# Altium schematic sheet Sheet2.SchDoc
size A
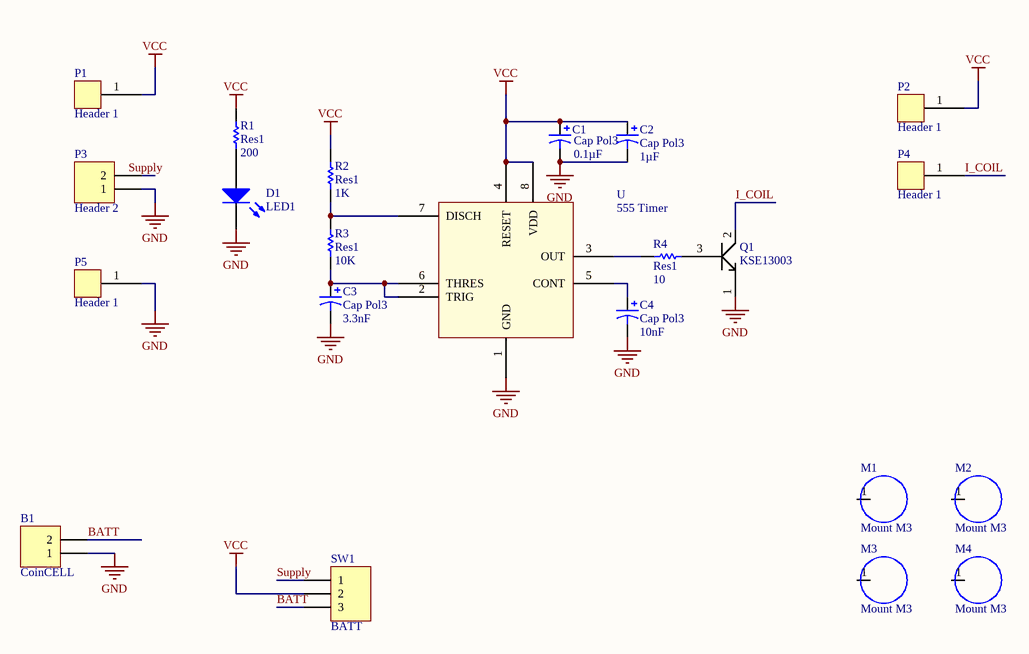
[diagram p0: Sheet2.SchDoc]

## Parts
B1  CoinCELL  [COIN]
C1  Cap Pol3  value 0.1µF  [C0805]
C2  Cap Pol3  value 1µF  [C0805]
C3  Cap Pol3  value 3.3nF  [C0805]
C4  Cap Pol3  value 10nF  [C0805]
D1  LED1  [0805]
M1  Mount M3  [M3]
M2  Mount M3  [M3]
M3  Mount M3  [M3]
M4  Mount M3  [M3]
P1  Header 1  [Pad Edge]
P2  Header 1  [Pad]
P3  Header 2  [Screw Terminal 2-5.08]
P4  Header 1  [Pad]
P5  Header 1  [Pad Edge]
Q1  KSE13003  [TO126]
R1  Res1  value 200  [0805]
R2  Res1  value 1K  [0805]
R3  Res1  value 10K  [0805]
R4  Res1  value 10  [0805]
SW1  BATT  [Switch SPDT BENT]
U  555 Timer  [SOIC8]

## Nets
GND: B1.1 C1.2 C2.2 C3.2 C4.2 D1.2(K) P3.1 P5.1 Q1.1(Emitter) U.1(GND)
VCC: C1.1 C2.1 P1.1 P2.1 R1.2 R2.2 SW1.2 U.4(RESET) U.8(VDD)
BATT: B1.2 SW1.3
I_COIL: P4.1 Q1.2(Coll)
Supply: SW1.1
NetC3_1: C3.1 R3.1 U.2(TRIG) U.6(THRES)
NetC4_1: C4.1 U.5(CONT)
NetD1_1: D1.1(A) R1.1
NetQ1_3: Q1.3(Base) R4.1
NetR2_1: R2.1 R3.2 U.7(DISCH)
NetR4_2: R4.2 U.3(OUT)

Not connected (* = marked no-connect by the designer): M1 1; M2 1; M3 1; M4 1; P3 2

## Notes on the sheet
- Labels drawn without touching a wire or pin: Supply

## Library data of the parts
B1 P3 = Header 2: Header, 2-Pin; LatestRevisionDate: 17-Jul-2002; LatestRevisionNote: Re-released for DXP Platform.; Publisher: Altium Limited
C1-C4 = Cap Pol3: Polarized Capacitor (Surface Mount); Published: 8-Jun-2000; LatestRevisionDate: 29-May-2009; LatestRevisionNote: IPC-7351 Footprint Added.; PackageReference: C0805; Publisher: Altium Limited; PackageDescription: Chip Capacitor
D1 = LED1: Typical RED GaAs LED; Published: 8-Jun-2000; LatestRevisionDate: 08-Jul-2005; LatestRevisionNote: Mech Layer 1 removed.; PackageReference: LED-1; Publisher: Altium Limited; PackageDescription: LED; 2 Leads
Q1 = NPN_ECB
R1-R4 = Res1: Resistor; Published: 8-Jun-2000; LatestRevisionDate: 17-Jul-2002; LatestRevisionNote: Re-released for DXP Platform.; PackageReference: AXIAL-0.3; Publisher: Altium Limited; PackageDescription: Axial Device, Thru-Hole; 2 Leads; 0.3 in Pin Spacing
SW1 = Header 3: Header, 3-Pin; LatestRevisionDate: 17-Jul-2002; LatestRevisionNote: Re-released for DXP Platform.; Publisher: Altium Limited